# Altium schematic sheet SCH_A1_Temp.SchDoc
size A1
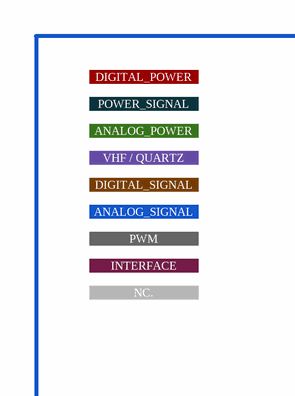
[diagram p0: SCH_A1_Temp.SchDoc, top left]
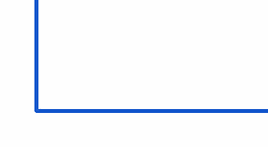
[diagram p1: SCH_A1_Temp.SchDoc, bottom left]

## Ports
ANALOG_POWER, ANALOG_SIGNAL, DIGITAL_POWER, DIGITAL_SIGNAL, INTERFACE, NC., POWER_SIGNAL, PWM, VHF / QUARTZ